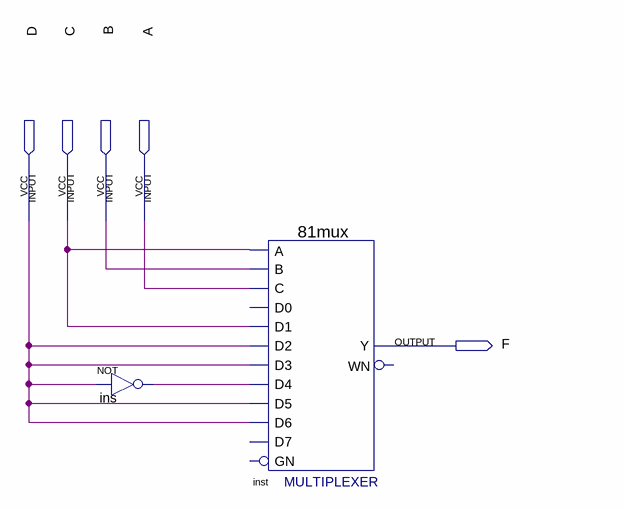
[diagram p0: schematic sheet]
// Quartus schematic Block1.bdf as structural Verilog: 2 symbols, 5 pins
module Block1 (
  input  D,
  input  C,
  input  B,
  input  A,
  output F
);

  wire ins_out;

  not ins (ins_out, D);
  \81mux  inst (
    .C(A), .D1(C), .D5(D), .D4(ins_out), .D2(D), .D3(D), .D6(D), .A(C), .B(B), .Y(F));  // open: D0, GN, D7, WN
endmodule
